# Altium project MainBoard_V1p0.PrjPcb
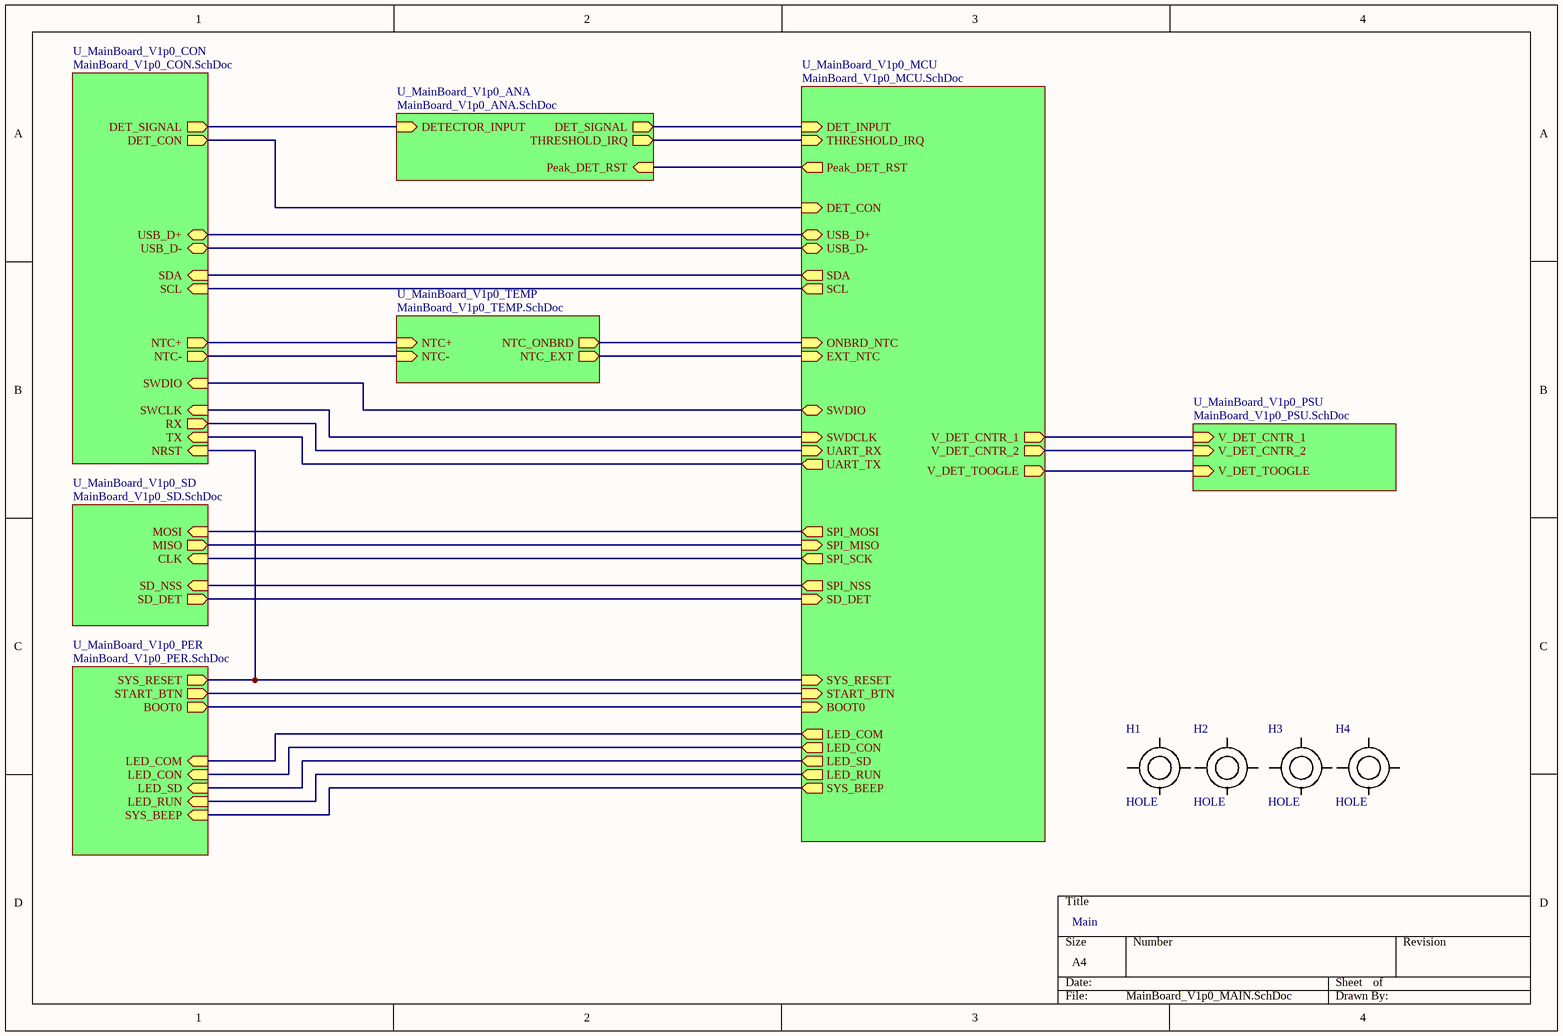
[diagram p0: MainBoard_V1p0_MAIN.SchDoc]
8 sheets, 206 parts. Net scope: hierarchical (ports join the sheet entries above them; power ports are global).
Board file: MainBoard_V1p0.PcbDoc
Sheets:
  MainBoard_V1p0_MAIN.SchDoc
    U_MainBoard_V1p0_ANA = MainBoard_V1p0_ANA.SchDoc
    U_MainBoard_V1p0_CON = MainBoard_V1p0_CON.SchDoc
    U_MainBoard_V1p0_MCU = MainBoard_V1p0_MCU.SchDoc
    U_MainBoard_V1p0_PER = MainBoard_V1p0_PER.SchDoc
    U_MainBoard_V1p0_PSU = MainBoard_V1p0_PSU.SchDoc
    U_MainBoard_V1p0_SD = MainBoard_V1p0_SD.SchDoc
    U_MainBoard_V1p0_TEMP = MainBoard_V1p0_TEMP.SchDoc

## Sheet MainBoard_V1p0_MAIN.SchDoc
size A4; SheetNumber: 1; SheetTotal: 8

### Parts
H1  HOLE  [HOLE_140_160MIL]
H2  HOLE  [HOLE_140_160MIL]
H3  HOLE  [HOLE_140_160MIL]
H4  HOLE  [HOLE_140_160MIL]

### Sub-sheets
U_MainBoard_V1p0_ANA = MainBoard_V1p0_ANA.SchDoc: DETECTOR_INPUT (in), DET_SIGNAL (out), Peak_DET_RST (in), THRESHOLD_IRQ (out)
U_MainBoard_V1p0_CON = MainBoard_V1p0_CON.SchDoc: USB_D- (bidir), USB_D+ (bidir), DET_SIGNAL (out), NTC+ (out), NTC- (out), SCL (in), SDA (in), DET_CON (out), RX (out), SWCLK (in), SWDIO (in), NRST (in), TX (in)
U_MainBoard_V1p0_MCU = MainBoard_V1p0_MCU.SchDoc: SPI_NSS (out), SPI_SCK (out), SPI_MISO (in), SPI_MOSI (out), SCL (out), SDA (out), DET_INPUT (in), ONBRD_NTC (in), EXT_NTC (in), THRESHOLD_IRQ (in), SYS_RESET (in), START_BTN (in), SYS_BEEP (out), LED_COM (out), LED_CON (out), LED_SD (out), LED_RUN (out), UART_TX (out), UART_RX (in), USB_D- (bidir), USB_D+ (bidir), SWDIO (bidir), SWDCLK (in), Peak_DET_RST (out), V_DET_CNTR_1 (out), V_DET_CNTR_2 (out), BOOT0 (in), DET_CON (in), SD_DET (in), V_DET_TOOGLE (out)
U_MainBoard_V1p0_PER = MainBoard_V1p0_PER.SchDoc: LED_COM (in), LED_CON (in), LED_SD (in), LED_RUN (in), SYS_BEEP (in), SYS_RESET (out), START_BTN (out), BOOT0 (out)
U_MainBoard_V1p0_PSU = MainBoard_V1p0_PSU.SchDoc: V_DET_CNTR_1 (in), V_DET_CNTR_2 (in), V_DET_TOOGLE (in)
U_MainBoard_V1p0_SD = MainBoard_V1p0_SD.SchDoc: SD_DET (out), SD_NSS (in), MOSI (in), CLK (in), MISO (out)
U_MainBoard_V1p0_TEMP = MainBoard_V1p0_TEMP.SchDoc: NTC+ (in), NTC- (in), NTC_ONBRD (out), NTC_EXT (out)

### Nets
BOOT0: sheet U_MainBoard_V1p0_MCU/BOOT0, sheet U_MainBoard_V1p0_PER/BOOT0
CLK: sheet U_MainBoard_V1p0_MCU/SPI_SCK, sheet U_MainBoard_V1p0_SD/CLK
DET_CON: sheet U_MainBoard_V1p0_CON/DET_CON, sheet U_MainBoard_V1p0_MCU/DET_CON
DET_SIGNAL: sheet U_MainBoard_V1p0_ANA/DETECTOR_INPUT, sheet U_MainBoard_V1p0_CON/DET_SIGNAL
EXT_NTC: sheet U_MainBoard_V1p0_MCU/EXT_NTC, sheet U_MainBoard_V1p0_TEMP/NTC_EXT
LED_COM: sheet U_MainBoard_V1p0_MCU/LED_COM, sheet U_MainBoard_V1p0_PER/LED_COM
LED_CON: sheet U_MainBoard_V1p0_MCU/LED_CON, sheet U_MainBoard_V1p0_PER/LED_CON
LED_RUN: sheet U_MainBoard_V1p0_MCU/LED_RUN, sheet U_MainBoard_V1p0_PER/LED_RUN
LED_SD: sheet U_MainBoard_V1p0_MCU/LED_SD, sheet U_MainBoard_V1p0_PER/LED_SD
MISO: sheet U_MainBoard_V1p0_MCU/SPI_MISO, sheet U_MainBoard_V1p0_SD/MISO
MOSI: sheet U_MainBoard_V1p0_MCU/SPI_MOSI, sheet U_MainBoard_V1p0_SD/MOSI
NTC+: sheet U_MainBoard_V1p0_CON/NTC+, sheet U_MainBoard_V1p0_TEMP/NTC+
NTC-: sheet U_MainBoard_V1p0_CON/NTC-, sheet U_MainBoard_V1p0_TEMP/NTC-
ONBRD_NTC: sheet U_MainBoard_V1p0_MCU/ONBRD_NTC, sheet U_MainBoard_V1p0_TEMP/NTC_ONBRD
Peak_DET_RST: sheet U_MainBoard_V1p0_ANA/Peak_DET_RST, sheet U_MainBoard_V1p0_MCU/Peak_DET_RST
SCL: sheet U_MainBoard_V1p0_CON/SCL, sheet U_MainBoard_V1p0_MCU/SCL
SD_DET: sheet U_MainBoard_V1p0_MCU/SD_DET, sheet U_MainBoard_V1p0_SD/SD_DET
SD_NSS: sheet U_MainBoard_V1p0_MCU/SPI_NSS, sheet U_MainBoard_V1p0_SD/SD_NSS
SDA: sheet U_MainBoard_V1p0_CON/SDA, sheet U_MainBoard_V1p0_MCU/SDA
START_BTN: sheet U_MainBoard_V1p0_MCU/START_BTN, sheet U_MainBoard_V1p0_PER/START_BTN
SWDCLK: sheet U_MainBoard_V1p0_CON/SWCLK, sheet U_MainBoard_V1p0_MCU/SWDCLK
SWDIO: sheet U_MainBoard_V1p0_CON/SWDIO, sheet U_MainBoard_V1p0_MCU/SWDIO
SYS_BEEP: sheet U_MainBoard_V1p0_MCU/SYS_BEEP, sheet U_MainBoard_V1p0_PER/SYS_BEEP
SYS_RESET: sheet U_MainBoard_V1p0_CON/NRST, sheet U_MainBoard_V1p0_MCU/SYS_RESET, sheet U_MainBoard_V1p0_PER/SYS_RESET
THRESHOLD_IRQ: sheet U_MainBoard_V1p0_ANA/THRESHOLD_IRQ, sheet U_MainBoard_V1p0_MCU/THRESHOLD_IRQ
UART_RX: sheet U_MainBoard_V1p0_CON/RX, sheet U_MainBoard_V1p0_MCU/UART_RX
UART_TX: sheet U_MainBoard_V1p0_CON/TX, sheet U_MainBoard_V1p0_MCU/UART_TX
USB_D+: sheet U_MainBoard_V1p0_CON/USB_D+, sheet U_MainBoard_V1p0_MCU/USB_D+
USB_D-: sheet U_MainBoard_V1p0_CON/USB_D-, sheet U_MainBoard_V1p0_MCU/USB_D-
V_DET_CNTR_1: sheet U_MainBoard_V1p0_MCU/V_DET_CNTR_1, sheet U_MainBoard_V1p0_PSU/V_DET_CNTR_1
V_DET_CNTR_2: sheet U_MainBoard_V1p0_MCU/V_DET_CNTR_2, sheet U_MainBoard_V1p0_PSU/V_DET_CNTR_2
V_DET_TOOGLE: sheet U_MainBoard_V1p0_MCU/V_DET_TOOGLE, sheet U_MainBoard_V1p0_PSU/V_DET_TOOGLE
NetR31_1: sheet U_MainBoard_V1p0_ANA/DET_SIGNAL, sheet U_MainBoard_V1p0_MCU/DET_INPUT

### Notes on the sheet
- Main

## Sheet MainBoard_V1p0_ANA.SchDoc
size A4; SheetNumber: 4; SheetTotal: 8
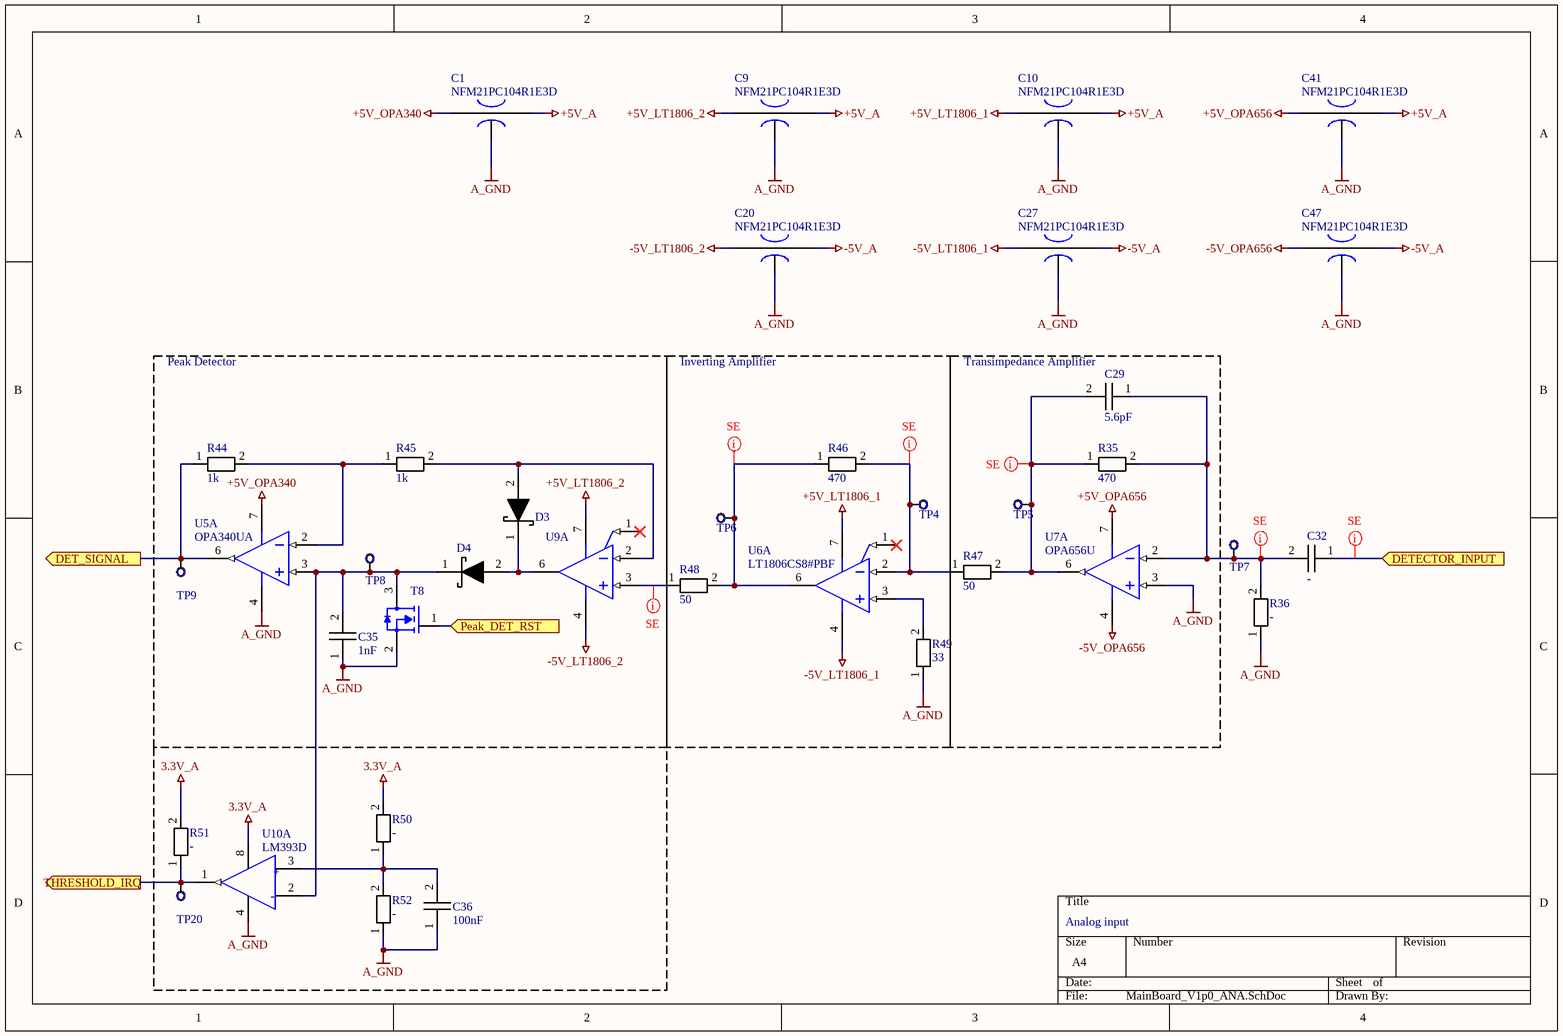
[diagram p1: MainBoard_V1p0_ANA.SchDoc]

### Parts
C1  NFM21PC104R1E3D  [MURATA_NFM21]
C9  NFM21PC104R1E3D  [MURATA_NFM21]
C10  NFM21PC104R1E3D  [MURATA_NFM21]
C20  NFM21PC104R1E3D  [MURATA_NFM21]
C27  NFM21PC104R1E3D  [MURATA_NFM21]
C29  5.6pF  [0805_C]
C32  -  [0805_C]
C35  1nF  [0805_C]
C36  100nF  [0805_C]
C41  NFM21PC104R1E3D  [MURATA_NFM21]
C47  NFM21PC104R1E3D  [MURATA_NFM21]
D3  DIODE_SCHOTTKY  [SMD_DIODE_SOD80]  (value not drawn)
D4  DIODE_SCHOTTKY  [SMD_DIODE_SOD80]  (value not drawn)
R35  470  [0805]
R36  -  [0805]
R44  1k  [0805]
R45  1k  [0805]
R46  470  [0805]
R47  50  [0805]
R48  50  [0805]
R49  33  [0805]
R50  -  [0805]
R51  -  [0805]
R52  -  [0805]
T8  MMBF170  [SOT23]  (value not drawn)
TP4  ?  [PAD_40]  (value not drawn)  (no BOM)
TP5  ?  [PAD_40]  (value not drawn)  (no BOM)
TP6  ?  [PAD_40]  (value not drawn)  (no BOM)
TP7  ?  [PAD_40]  (value not drawn)  (no BOM)
TP8  ?  [PAD_40]  (value not drawn)  (no BOM)
TP9  ?  [PAD_40]  (value not drawn)  (no BOM)
TP20  ?  [PAD_40]  (value not drawn)  (no BOM)
U5  OPA340UA  [SO-8]  (part A of 2)
U6  LT1806CS8#PBF  [SO-8]  (part A of 2)
U7  OPA656U  [SO-8]  (part A of 2)
U9  LT1806CS8#PBF  [SO-8]  (value not drawn)  (part A of 2)
U10  LM393D  [SO-8]  (part A of 2)

### Blocks framed on the sheet
Peak Detector: C35 D3 D4 R44 R45 T8 TP8 TP9 U5 U9
Inverting Amplifier: R46 R48 R49 TP4 TP6 U6
Transimpedance Amplifier: C29 R35 R47 TP5 U7

### Ports
DET_SIGNAL (out), DETECTOR_INPUT (in), Peak_DET_RST (in), THRESHOLD_IRQ (out)

### Nets
3.3V_A: R50.2 R51.2 U10.8(Vcc+)
+5V_A: C1.3(OUT) C9.3(OUT) C10.3(OUT) C41.3(OUT)
+5V_LT1806_1: C10.1(IN) U6.7(V+)
+5V_LT1806_2: C9.1(IN) U9.7(V+)
+5V_OPA340: C1.1(IN) U5.7(V+)
+5V_OPA656: C41.1(IN) U7.7(VS+)
-5V_A: C20.3(OUT) C27.3(OUT) C47.3(OUT)
-5V_LT1806_1: C27.1(IN) U6.4(V-)
-5V_LT1806_2: C20.1(IN) U9.4(V-)
-5V_OPA656: C47.1(IN) U7.4(VS-)
A_GND: C1.2(GND) C9.2(GND) C10.2(GND) C20.2(GND) C27.2(GND) C35.1 C36.1 C41.2(GND) C47.2(GND) R36.1 R49.1 R52.1 T8.2(Source) U5.4(V-) U7.3(IN+) U10.4(Vcc-)
DET_SIGNAL: C32.1 ; port DETECTOR_INPUT
Peak_DET_RST: T8.1(Gate) ; port Peak_DET_RST
THRESHOLD_IRQ: R51.1 TP20.1 U10.1(Out1) ; port THRESHOLD_IRQ
NetC29_1: C29.1 C32.2 R35.2 R36.2 TP7.1 U7.2(IN-)
NetC29_2: C29.2 R35.1 R47.2 TP5.1 U7.6(OUT)
NetC35_2: C35.2 D4.1 T8.3(Drain) TP8.1 U5.3(IN+) U10.2(In1-)
NetC36_2: C36.2 R50.1 R52.2 U10.3(In1+)
NetD3_1: D3.1 D4.2 U9.6(OUT)
NetD3_2: D3.2 R45.2 U9.2(-IN)
NetR31_1: R44.1 TP9.1 U5.6(OUT) ; port DET_SIGNAL
NetR44_2: R44.2 R45.1 U5.2(IN-)
NetR46_1: R46.1 R48.2 TP6.1 U6.6(OUT)
NetR46_2: R46.2 R47.1 TP4.1 U6.2(-IN)
NetR48_1: R48.1 U9.3(+IN)
NetR49_2: R49.2 U6.3(+IN)

Not connected (* = marked no-connect by the designer): U6 1(~{SHDN})*; U9 1(~{SHDN})*

### Layout directives
net class SINGLE50: DET_SIGNAL, NetC29_1, NetC29_2, NetR46_1, NetR46_2, NetR48_1

### Notes on the sheet
- Analog input
- (in symbol LM393D, part A) +; -

### Library data of the parts
C1 C9 C10 C20 C27 C41 C47 = EMIFIL_CAP: NFM21PC104R1E3D / 100nF/25V
C29 C32 C35 C36 = CAPACITOR
R35 R36 R44-R52 = RESISTOR: Parameter 1: 10k
T8 = MMBF170: N MOSFET
TP4-TP9 TP20 = TESTPOINT
U5 = OPA340UA: Single-Supply, Rail-to-Rail Operational Amplifier MicroAmplifier(TM) Series, 2.7 to 5.5 V, -40 to 85 degC, 8-pin SOIC (D8), Green (RoHS & no Sb/Br); Manufacturer: Texas Instruments; Vio (25C)(Max)(mV): 0.5; Sub Family: Low Input Bias Current Amp (<=10pA), Low Offset Voltage Amplifier (<=500uV), Low Supply Voltage Amplifier (<=2.7V), Precision Amplifier; Vn at 1kHz(Typ)(nV/rtHz): 25; Number of Channels: 1; Offset Drift(Typ)(uV/C): 2.5; Total Supply Voltage(Min)(+5V is 5, +/-5V is 10): 2.7; Slew Rate(Typ)(V/us): 6; Total Supply Voltage(Max)(+5V is 5, +/-5V is 10): 5.5; Iq per channel(Max)(mA): 0.95; CMRR(Min)(dB): 80; IIB(Max)(pA): 10; Code_JEDEC: MS-012; PackageDescription: 8-Pin Plastic Small Outline, Body 4.9 x 3.9 mm, Pitch 1.27 mm; ComponentLink3Description: Package Specification; ComponentLink1Description: Manufacturer URL; DatasheetVersion: SBOS073B; PackageReference: D0008A; PackageVersion: 4040047-3/M, 06/2011; ComponentLink3URL: http://www.ti.com/litv/pdf/msoi002j; ComponentLink1URL: http://www.ti.com/; Mounting Technology: Surface Mount; ComponentLink2URL: http://www.ti.com/general/docs/lit/getliterature.tsp?genericPartNumber=OPA340&fileType=pdf; PartNumber: OPA340UA; ComponentLink2Description: Datasheet; Eco-Plan: Green (RoHS & no Sb/Br)
U6 U9 = LT1806: Single Channel, High Speed, Low Noise Precision Operational Amplifier, 325 MHz Typical GBW, 125 V/us Typical SR, 2.5 to 12.6 V, 8-Pin SOIC (S8-8), Commercial, Pb-Free; Manufacturer: Linear Technology; Is (mA) Typical: 9; GBW (MHz) Typical: 325; SR (V/us) Typical: 125; Vos (mV) Guaranteed: 0.55; Vos (mV) Typical: 0.1; Vs Max (V): 12.6; Vs Min (V): 2.5; Channels (#): 1; DatasheetVersion: Rev. C; ComponentLink3Description: Package Specification; Mounting Technology: Surface Mount; ComponentLink2Description: Datasheet; RevisionNote: URLs updated; PackageDescription: 8-Pin Plastic Small Outline, Body 4.9 x 3.9 mm, Pitch 1.27 mm; PackageVersion: Rev G; RoHS: Pb-Free; Type: VFB; PackageReference: LT-S8-8; ComponentLink2URL: http://cds.linear.com/docs/en/datasheet/18067fc.pdf; Linear Technology Part Number: LT1806; ComponentLink3URL: http://cds.linear.com/docs/en/packaging/05081610_G_SO8.pdf; PartNumber: LT1806CS8#PBF; ComponentLink1Description: Manufacturer URL; ComponentLink1URL: http://www.linear.com/
U7 = OPA656: Wideband, Unity Gain Stable FET-Input Operational Amplifier, 10 to 12 V, -40 to 85 degC, 8-pin SOIC (D8), Green (RoHS & no Sb/Br); Manufacturer: Texas Instruments; BW @ Acl(MHz): 500; Acl, min stable gain(V/V): 1; THD (Fc is 1 MHz)(Typ)(dB): -74; Io(Typ)(mA): 70; @ MHz: 5; Vn at Flatband(Typ)(nV/rtHz): 7; 3rd Harmonic(dBc): 100; Slew Rate(Typ)(V/us): 290; 2nd Harmonic(dBc): 74; Vs(Min)(V): 10; Vs(Max)(V): 12; Iib(Max)(nA): 0.02; Settling Time (0.1%)(Typ)(ns): 16; Vio(Max)(mV): 0.6; Diff Phase(deg): 0.05; Sub Family: High Output Current Amplifier (>=50mA), High Speed Amplifier (>=50MHz), Low Input Bias Current Amp (<=10pA); PartNumber: OPA656U; ComponentLink1URL: http://www.ti.com/; ComponentLink2URL: http://www.ti.com/general/docs/lit/getliterature.tsp?genericPartNumber=OPA656&fileType=pdf; Mounting Technology: Surface Mount; Code_JEDEC: MS-012; PackageReference: D0008A; ComponentLink3URL: http://www.ti.com/litv/pdf/msoi002j; PackageVersion: 4040047-3/M, 06/2011; ComponentLink3Description: Package Specification; Number of Channels: 1; DatasheetVersion: SBOS196G; Iq per channel(Max)(mA): 16; ComponentLink2Description: Datasheet; ComponentLink1Description: Manufacturer URL; Eco-Plan: Green (RoHS & no Sb/Br); Diff Gain(%): 0.02; PackageDescription: 8-Pin Plastic Small Outline, Body 4.9 x 3.9 mm, Pitch 1.27 mm
U10 = LM393D: IC VOLT COMPARATOR DUAL LP 8SOIC; Manufacturer: STMicroelectronics; Response Time: 1.3us; Min Supply Voltage: 2V; Input Offset Voltage: 1mV; Input Bias Current: 0.02uA; Max Dual Supply Voltage: 18V; Output Current Per Channel: 18mA; Max Junction Temp: +150°C; Standoff Height: 0.1mm; Number Of Channels: 2; Nominal Supply Current: 0.45-0.6mA; Voltage Gain: 200V/mV; Max Supply Voltage: 36V; Min Dual Supply Voltage: 1V; Ambient Temperature Range Low: 0°C; ComponentLink2Description: Datasheet; Lead Free: Yes; Device Class L3: Comparators; Device Class L2: Linear ICs; Manufacturer Part Number: LM393D; Digikey Description: IC VOLT COMPARATOR DUAL LP 8SOIC; Category: IC; Octopart: https://octopart.com/lm393d-stmicroelectronics-25832; Package: SO8; RoHS: TRUE; Footprint Url: https://www.st.com/resource/en/datasheet/stm8l001j3.pdf; Temperature Range Low: 0°C; Temperature Range High: +70°C; Mouser Description: Analog Comparators Lo-Pwr Dual Voltage; ComponentLink2URL: https://www.st.com/resource/en/datasheet/lm393.pdf; Automotive: No; Temperature: 0°C to +70°C; Height: 1.75mm; Device Class L1: Integrated Circuits (ICs); Ambient Temperature Range High: +70°C

## Sheet MainBoard_V1p0_CON.SchDoc
size A4; SheetNumber: 6; SheetTotal: 8
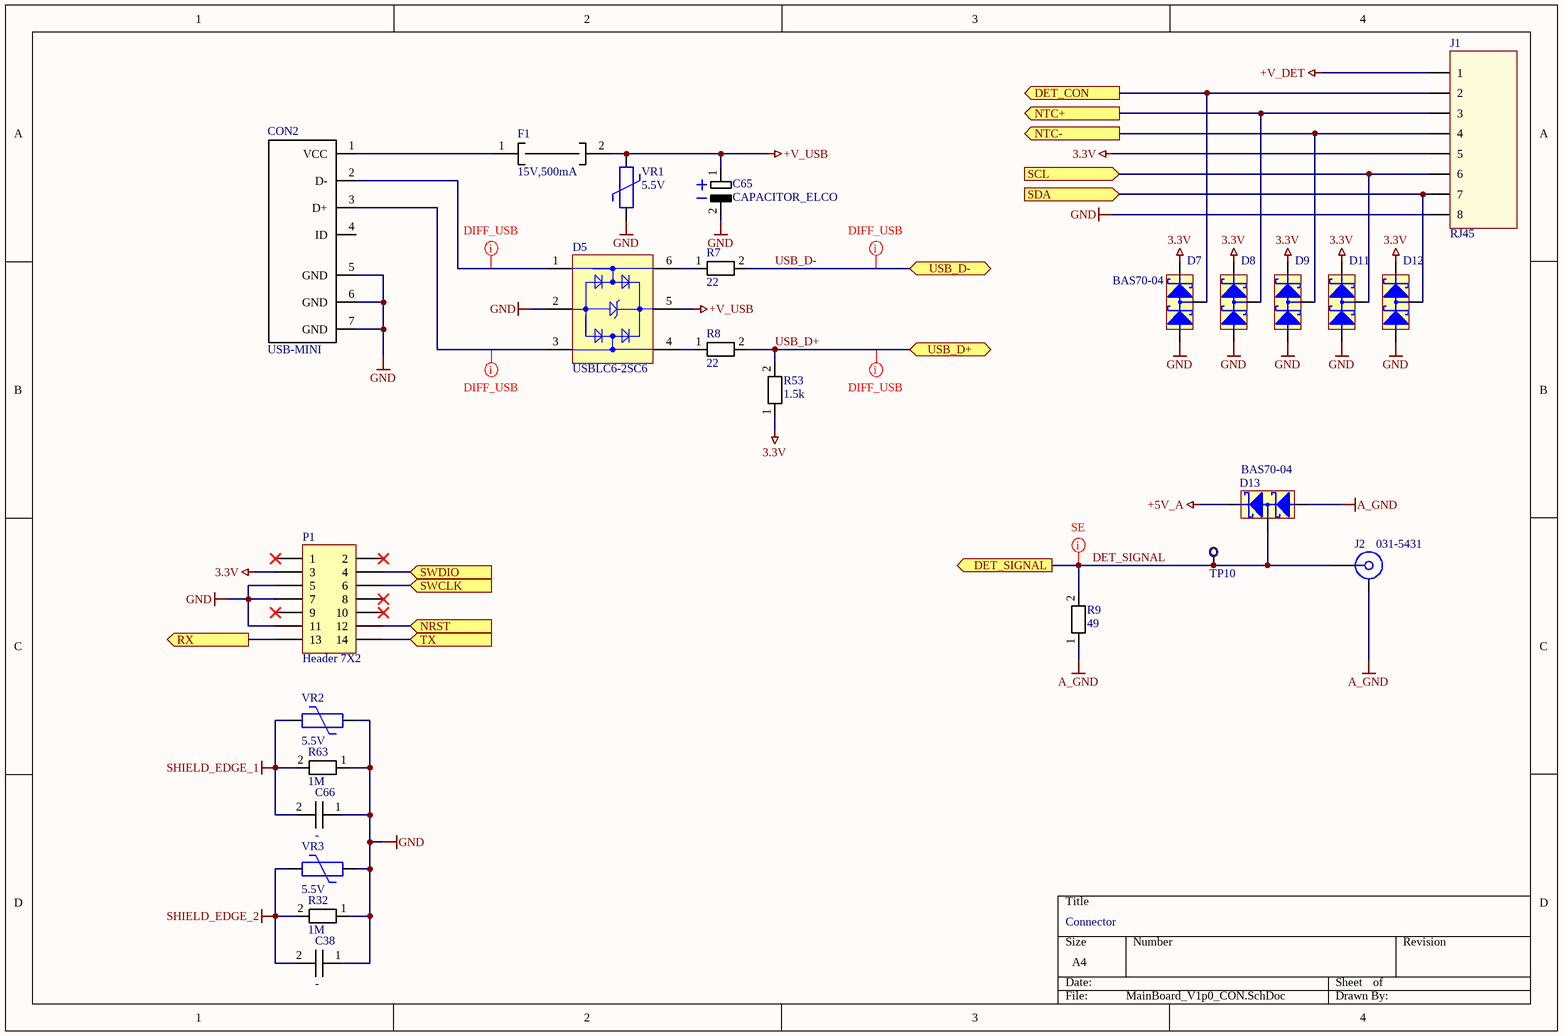
[diagram p2: MainBoard_V1p0_CON.SchDoc]

### Parts
C38  -  [0805_C]
C65  CAPACITOR_ELCO  [CAPAE9383X110M]
C66  -  [0805_C]
CON2  USB-MINI  [USB-MINI]
D5  USBLC6-2SC6  [STM-SOT23-6L_V]
D7  BAS70-04  [SOT23]
D8  BAS70-04  [SOT23]  (value not drawn)
D9  BAS70-04  [SOT23]  (value not drawn)
D11  BAS70-04  [SOT23]  (value not drawn)
D12  BAS70-04  [SOT23]  (value not drawn)
D13  BAS70-04  [SOT23]
F1  15V,500mA  [FUSE_1812L]
J1  RJ45  [RJ45_DEG90]
J2  031-5431  [CON_BNC_TE_ZDC]
P1  Header 7X2  [HDR2X7]
R7  22  [0805]
R8  22  [0805]
R9  49  [0805]
R32  1M  [0805]
R53  1.5k  [0805]
R63  1M  [0805]
TP10  ?  [PAD_40]  (value not drawn)  (no BOM)
VR1  5.5V  [0805]
VR2  5.5V  [0805]
VR3  5.5V  [0805]

### Ports
DET_CON (out), DET_SIGNAL (out), NRST (in), NTC+ (out), NTC- (out), RX (out), SCL (in), SDA (in), SWCLK (in), SWDIO (in), TX (in), USB_D+ (bidir), USB_D- (bidir)

### Nets
3.3V: D7.2 D8.2 D9.2 D11.2 D12.2 J1.5 P1.3 R53.1
+5V_A: D13.2
+V_DET: J1.1
+V_USB: C65.1 D5.5(VBUS) F1.2 VR1.2
A_GND: D13.1 J2.2,3,4(GND) R9.1
GND: C38.1 C65.2 C66.1 CON2.5(GND) CON2.6(GND) CON2.7(GND) D5.2(GND) D7.1 D8.1 D9.1 D11.1 D12.1 J1.8 P1.5 P1.7 P1.11 R32.1 R63.1 VR1.1 VR2.1 VR3.1
SHIELD_EDGE_1: C66.2 R63.2 VR2.2
SHIELD_EDGE_2: C38.2 R32.2 VR3.2
DET_CON: D7.3 J1.2 ; port DET_CON
DET_SIGNAL: D13.3 J2.1(SIGNAL) R9.2 TP10.1 ; port DET_SIGNAL
NTC+: D8.3 J1.3 ; port NTC+
NTC-: D9.3 J1.4 ; port NTC-
SCL: D11.3 J1.6 ; port SCL
SDA: D12.3 J1.7 ; port SDA
SWDCLK: P1.6 ; port SWCLK
SWDIO: P1.4 ; port SWDIO
SYS_RESET: P1.12 ; port NRST
UART_RX: P1.13 ; port RX
UART_TX: P1.14 ; port TX
USB_D+: R8.2 R53.2 ; port USB_D+
USB_D-: R7.2 ; port USB_D-
NetCON2_1: CON2.1(VCC) F1.1
NetCON2_2: CON2.2(D-) D5.1(I/O_1)
NetCON2_3: CON2.3(D+) D5.3(I/O_2)
NetD5_4: D5.4(I/O_3) R8.1
NetD5_6: D5.6(I/O_4) R7.1

Not connected (* = marked no-connect by the designer): CON2 4(ID); P1 1* 2* 8* 9* 10*

### Layout directives
net class D90: NetCON2_2, NetCON2_3, USB_D+, USB_D-
net class SINGLE50: DET_SIGNAL

### Notes on the sheet
- Connector

### Library data of the parts
C38 C66 = CAPACITOR
D5 = USBLC6-2SC6: Very low capacitance ESD protection, 3.5 pF, -40 to 125 degC, 6-Pin SOT23, RoHS, Tape and Reel; Manufacturer: STMicroelectronics; Polarity: Uni-Directional; Clamping Voltage: 17V; Rad Hardened: No; Product Height (mm): 1.3mm; Leakage Current (Max): 0.15uA; Product Length (mm): 3.05mm; Number of Elements: 1; Peak Pulse Current: 5A; Configuration: Dual; Reverse Breakdown Voltage: 6V; Working Voltage (Max): 5V; Capacitance Value: 3.5pF; Suppressor Type: DiodeArrays; Product Depth (mm): 1.75mm; Test Current (It): 1mA; Package / Case: SOT-23; Operating Temperature Max Deg. C: 125C; Package Description: 6-Pin Small Outline Transistor, Body 2.925 x 1.625 mm, Pitch 0.95 mm; Package Reference: SOT23-6L; Datasheet Version: Rev. 5, 10/2011; Operating Temperature Min Deg. C: -40C; Mounting Style: SurfaceMount; Direction Type: Uni-Directional; Mounting: SurfaceMount; Pin Count: 6; Leakage Current: 0.15uA; Packaging: TapeandReel; Operating Temperature Classification: Automotive; Clamping Voltage (Max): 17V; Manufacturer URL: http://www.st.com/; Reverse Stand-off Voltage: 5V; Datasheet URL: http://www.st.com/st-web-ui/static/active/en/resource/technical/document/datasheet/CD00050750.pdf; Working Voltage: 5V; Operating Temp Range: -40Cto125C
F1 = FUSE
J1 = RJ45: 90 deg RJ45 connector, without transformer / 180 deg RJ45 connector without transformer
J2 = Amphenol 031-5431: 50R BNC Right Angle Jack, Amphenol 031-5431
P1 = Header 7X2: Header, 7-Pin, Dual row; LatestRevisionDate: 17-Jul-2002; LatestRevisionNote: Re-released for DXP Platform.; Publisher: Altium Limited
R7-R9 R32 R53 R63 = RESISTOR: Parameter 1: 10k
TP10 = TESTPOINT
VR1-VR3 = VARISTOR

## Sheet MainBoard_V1p0_MCU.SchDoc
size A4; SheetNumber: 3; SheetTotal: 8
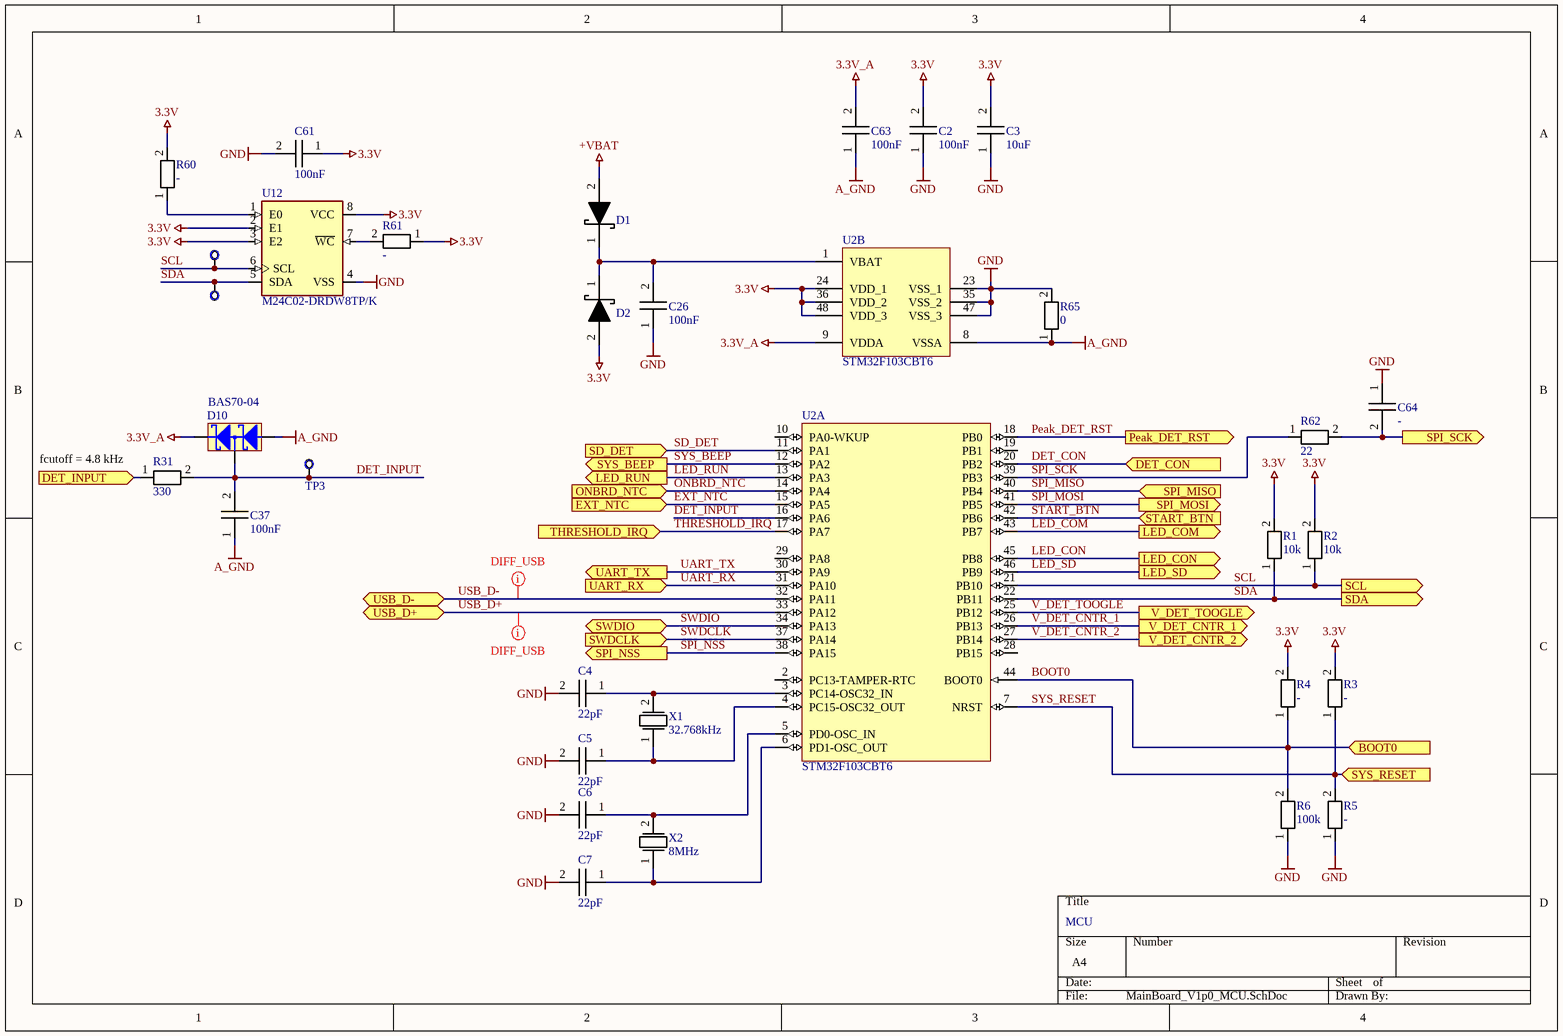
[diagram p3: MainBoard_V1p0_MCU.SchDoc]

### Parts
C2  100nF  [0805_C]
C3  10uF  [1210_C]
C4  22pF  [0805_C]
C5  22pF  [0805_C]
C6  22pF  [0805_C]
C7  22pF  [0805_C]
C26  100nF  [0805_C]
C37  100nF  [0805_C]
C61  100nF  [0805_C]
C63  100nF  [0805_C]
C64  -  [0805_C]
D1  DIODE_SCHOTTKY  [SMD_DIODE_SOD80]  (value not drawn)
D2  DIODE_SCHOTTKY  [SMD_DIODE_SOD80]  (value not drawn)
D10  BAS70-04  [SOT23]
R1  10k  [0805]
R2  10k  [0805]
R3  -  [0805]
R4  -  [0805]
R5  -  [0805]
R6  100k  [0805]
R31  330  [0805]
R60  -  [0805]
R61  -  [0805]
R62  22  [0805]
R65  0  [0805]
TP1  ?  [PAD_40]  (value not drawn)  (no BOM)
TP2  ?  [PAD_40]  (value not drawn)  (no BOM)
TP3  ?  [PAD_40]  (value not drawn)  (no BOM)
U2  STM32F103CBT6  [STM-LQFP48_N]  (parts A,B of 2)
U12  M24C02-DRDW8TP/K  [TSSOP8]
X1  32.768kHz  [XTAL_SMALL]
X2  8MHz  [XTAL_SMALL]

### Ports
BOOT0 (in), DET_CON (in), DET_INPUT (in), EXT_NTC (in), LED_COM (out), LED_CON (out), LED_RUN (out), LED_SD (out), ONBRD_NTC (in), Peak_DET_RST (out), SCL (out), SD_DET (in), SDA (out), SPI_MISO (in), SPI_MOSI (out), SPI_NSS (out), SPI_SCK (out), START_BTN (in), SWDCLK (in), SWDIO (bidir), SYS_BEEP (out), SYS_RESET (in), THRESHOLD_IRQ (in), UART_RX (in), UART_TX (out), USB_D+ (bidir), USB_D- (bidir), V_DET_CNTR_1 (out), V_DET_CNTR_2 (out), V_DET_TOOGLE (out)

### Nets
3.3V: C2.2 C3.2 C61.1 D2.2 R1.2 R2.2 R3.2 R4.2 R60.2 R61.1 U2.24(VDD_1) U2.36(VDD_2) U2.48(VDD_3) U12.2(E1) U12.3(E2) U12.8(VCC)
3.3V_A: C63.2 D10.2 U2.9(VDDA)
+VBAT: D1.2
A_GND: C37.1 C63.1 D10.1 R65.1 U2.8(VSSA)
GND: C2.1 C3.1 C4.2 C5.2 C6.2 C7.2 C26.1 C61.2 C64.1 R5.1 R6.1 R65.2 U2.23(VSS_1) U2.35(VSS_2) U2.47(VSS_3) U12.4(VSS)
BOOT0: R4.1 R6.2 U2.44(BOOT0) ; port BOOT0
CLK: C64.2 R62.2 ; port SPI_SCK
DET_CON: U2.20(PB2) ; port DET_CON
DET_INPUT: C37.2 D10.3 R31.2 TP3.1 U2.16(PA6)
EXT_NTC: U2.15(PA5) ; port EXT_NTC
LED_COM: U2.43(PB7) ; port LED_COM
LED_CON: U2.45(PB8) ; port LED_CON
LED_RUN: U2.13(PA3) ; port LED_RUN
LED_SD: U2.46(PB9) ; port LED_SD
ONBRD_NTC: U2.14(PA4) ; port ONBRD_NTC
Peak_DET_RST: U2.18(PB0) ; port Peak_DET_RST
SCL: R2.1 TP1.1 U2.21(PB10) U12.6(SCL) ; port SCL
SD_DET: U2.11(PA1) ; port SD_DET
SDA: R1.1 TP2.1 U2.22(PB11) U12.5(SDA) ; port SDA
SPI_MISO: U2.40(PB4) ; port SPI_MISO  [project net MISO]
SPI_MOSI: U2.41(PB5) ; port SPI_MOSI  [project net MOSI]
SPI_NSS: U2.38(PA15) ; port SPI_NSS  [project net SD_NSS]
SPI_SCK: R62.1 U2.39(PB3)
START_BTN: U2.42(PB6) ; port START_BTN
SWDCLK: U2.37(PA14) ; port SWDCLK
SWDIO: U2.34(PA13) ; port SWDIO
SYS_BEEP: U2.12(PA2) ; port SYS_BEEP
SYS_RESET: R3.1 R5.2 U2.7(NRST) ; port SYS_RESET
THRESHOLD_IRQ: U2.17(PA7) ; port THRESHOLD_IRQ
UART_RX: U2.31(PA10) ; port UART_RX
UART_TX: U2.30(PA9) ; port UART_TX
USB_D+: U2.33(PA12) ; port USB_D+
USB_D-: U2.32(PA11) ; port USB_D-
V_DET_CNTR_1: U2.26(PB13) ; port V_DET_CNTR_1
V_DET_CNTR_2: U2.27(PB14) ; port V_DET_CNTR_2
V_DET_TOOGLE: U2.25(PB12) ; port V_DET_TOOGLE
NetC4_1: C4.1 U2.3(PC14-OSC32_IN) X1.2
NetC5_1: C5.1 U2.4(PC15-OSC32_OUT) X1.1
NetC6_1: C6.1 U2.5(PD0-OSC_IN) X2.2
NetC7_1: C7.1 U2.6(PD1-OSC_OUT) X2.1
NetC26_2: C26.2 D1.1 D2.1 U2.1(VBAT)
NetR31_1: R31.1 ; port DET_INPUT
NetR60_1: R60.1 U12.1(E0)
NetR61_2: R61.2 U12.7(~{WC})

Not connected (* = marked no-connect by the designer): U2 2(PC13-TAMPER-RTC) 10(PA0-WKUP) 19(PB1) 28(PB15) 29(PA8)

### Layout directives
net class D90: USB_D+, USB_D-

### Notes on the sheet
- (near R31) fcutoff = 4.8 kHz
- MCU

### Library data of the parts
C2-C7 C26 C37 C61 C63 C64 = CAPACITOR
R1 R2 = RESISTOR: Parameter 1: 10k
R3-R6 R31 R60-R62 R65 = RESISTOR: Parameter 1: 10k
TP1-TP3 = TESTPOINT
U2 = STM32F103CBT6: ARM Cortex-M3 32-bit MCU, 128 KB Flash, 20 KB Internal RAM, 37 I/Os, 48-pin LQFP, -40 to 85 degC, Tray; Supply Voltage(Vcc) min (V): 2; Operating Frequency(F) (Processor speed) (MHz): 72; A/D Converter: 2x12-bit (10 Channel); FLASH Size (Prog) (kB): 128; Internal RAM Size (kB): 20; I/Os (High Current): 37; ComponentLink2Description: Datasheet; PackageReference: LQFP48; PartNumber: STM32F103CBT6; ComponentLink1Description: Manufacturer URL; DatasheetVersion: Rev. 16; PackageVersion: Rev. 6, 06/2013; Packing: Tray; ComponentLink1URL: http://www.st.com/web/en/home.html; Mounting Technology: Surface Mount; ComponentLink3URL: http://www.st.com/st-web-ui/static/active/en/resource/technical/document/datasheet/DM00058181.pdf; PackageDescription: 48-Pin Low Profile Quad Flat Package, 7 x 7 mm Body, 0.5 mm Pitch; Core: ARM Cortex-M3; ComponentLink3Description: Package Specification; ComponentLink2URL: http://www.st.com/st-web-ui/static/active/en/resource/technical/document/datasheet/CD00161566.pdf
U12 = M24C02-FDW6TP: EEPROM Memory IC 2Kb (256 x 8) I2C 400kHz 900ns 8-TSSOP; MF: STMicroelectronics; Package: TSSOP-8 STMicroelectronics; MP: M24C02-FDW6TP; Digi-Key_Part_Number: 497-15746-1-ND; Value: *; SnapEDA_Link: https://www.snapeda.com/parts/M24C02-FDW6TP/STMicroelectronics/view-part/1102461/?ref=snap
X1 X2 = XTAL

## Sheet MainBoard_V1p0_PER.SchDoc
size A4; SheetNumber: 5; SheetTotal: 8
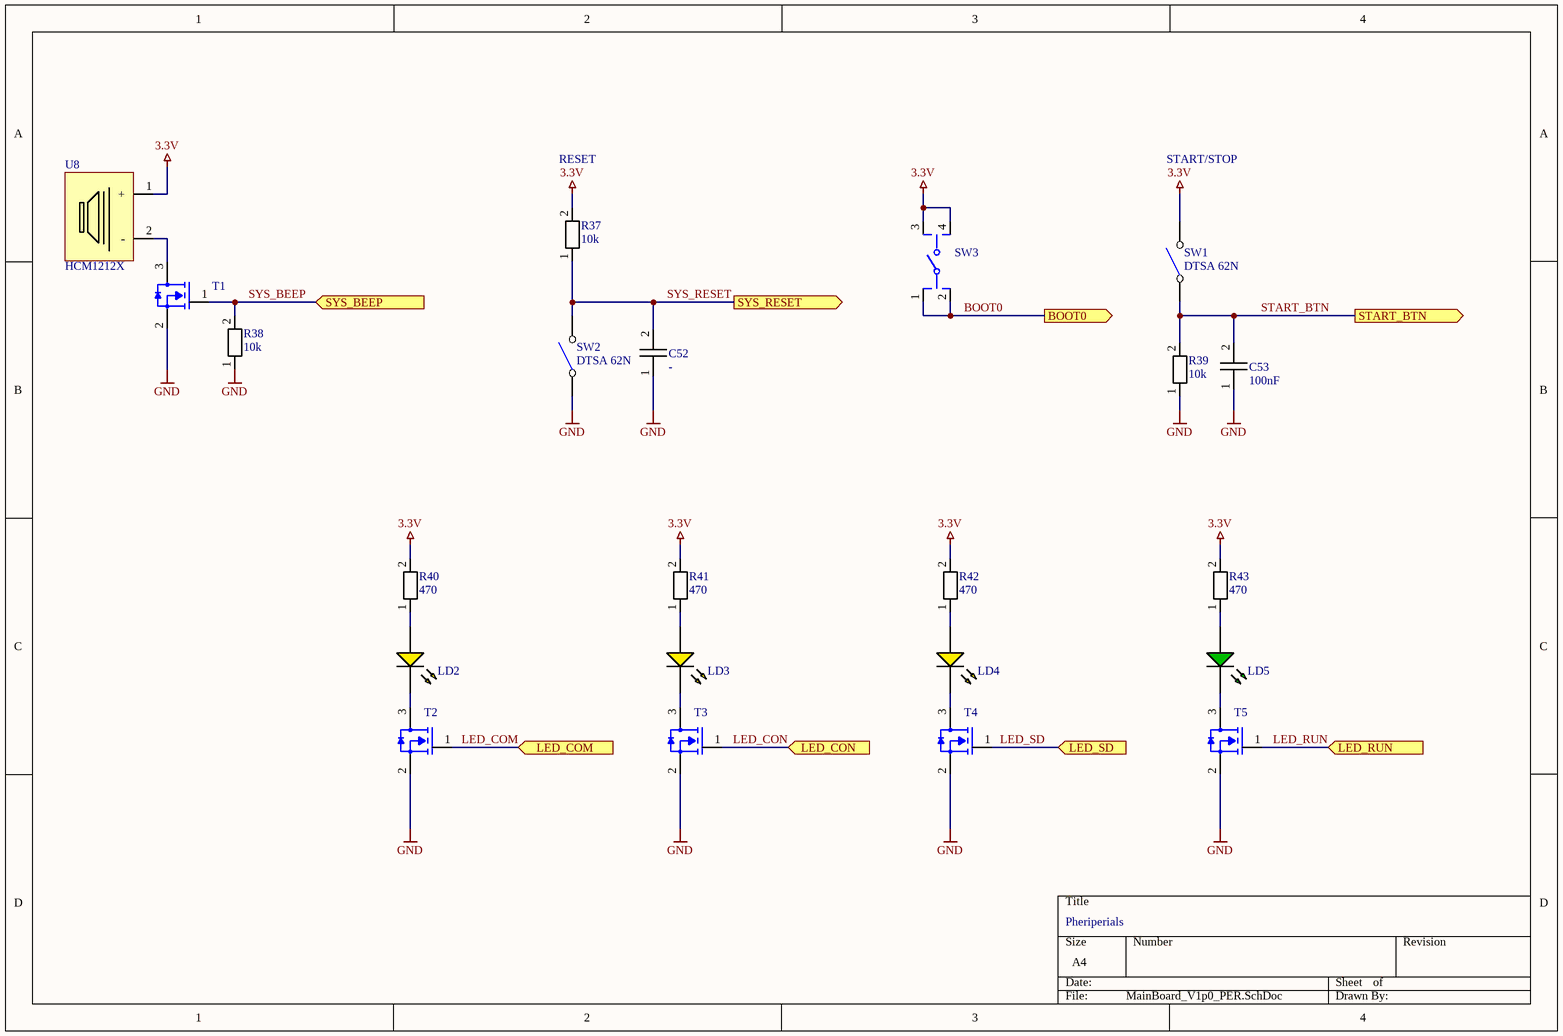
[diagram p4: MainBoard_V1p0_PER.SchDoc]

### Parts
C52  -  [0805_C]
C53  100nF  [0805_C]
LD2  LED_YEL  [LED_SMD_90DEG_YEL]  (value not drawn)
LD3  LED_YEL  [LED_SMD_90DEG_YEL]  (value not drawn)
LD4  LED_YEL  [LED_SMD_90DEG_YEL]  (value not drawn)
LD5  LED_GREEN  [LED_SMD_90DEG_GRE]  (value not drawn)
R37  10k  [0805]
R38  10k  [0805]
R39  10k  [0805]
R40  470  [0805]
R41  470  [0805]
R42  470  [0805]
R43  470  [0805]
SW1  DTSA 62N  [SW_DTSA-62N]
SW2  DTSA 62N  [SW_DTSA-62N]
SW3  Switch_C&K_KSC241JLFS_eec  [C&K_KSC241JLFS]  (value not drawn)
T1  MMBF170  [SOT23]  (value not drawn)
T2  MMBF170  [SOT23]  (value not drawn)
T3  MMBF170  [SOT23]  (value not drawn)
T4  MMBF170  [SOT23]  (value not drawn)
T5  MMBF170  [SOT23]  (value not drawn)
U8  HCM1212X  [HCM1212X]

### Ports
BOOT0 (out), LED_COM (in), LED_CON (in), LED_RUN (in), LED_SD (in), START_BTN (out), SYS_BEEP (in), SYS_RESET (out)

### Nets
3.3V: R37.2 R40.2 R41.2 R42.2 R43.2 SW1.2 SW3.3 SW3.4 U8.1(+)
GND: C52.1 C53.1 R38.1 R39.1 SW2.1 T1.2(Source) T2.2(Source) T3.2(Source) T4.2(Source) T5.2(Source)
BOOT0: SW3.1 SW3.2 ; port BOOT0
LED_COM: T2.1(Gate) ; port LED_COM
LED_CON: T3.1(Gate) ; port LED_CON
LED_RUN: T5.1(Gate) ; port LED_RUN
LED_SD: T4.1(Gate) ; port LED_SD
START_BTN: C53.2 R39.2 SW1.1 ; port START_BTN
SYS_BEEP: R38.2 T1.1(Gate) ; port SYS_BEEP
SYS_RESET: C52.2 R37.1 SW2.2 ; port SYS_RESET
NetLD2_A: LD2.A R40.1
NetLD2_K: LD2.K T2.3(Drain)
NetLD3_A: LD3.A R41.1
NetLD3_K: LD3.K T3.3(Drain)
NetLD4_A: LD4.A R42.1
NetLD4_K: LD4.K T4.3(Drain)
NetLD5_A: LD5.A R43.1
NetLD5_K: LD5.K T5.3(Drain)
NetT1_3: T1.3(Drain) U8.2(-)

### Notes on the sheet
- RESET
- START/STOP
- Pheriperials

### Library data of the parts
C52 C53 = CAPACITOR
LD2-LD4 = LED_YEL: Type (0°): LTSTC170YKT; Type (90°): HSMY-C110
LD5 = LED_GREEN: Type (0°): LTST-C170KGKT; Type (90°): HSMG-C110
R37-R39 = RESISTOR: Parameter 1: 10k
R40-R43 = RESISTOR: Parameter 1: 10k
SW1 SW2 = SW_DTSA 62N
SW3 = Switch_C&K_KSC241JLFS_eec: SWITCH TACTILE SPST-NO 0.05A 32V; Manufacturer: C&K; Part Number: KSC241JLFS; helpURL: https://upverter.com/upn/revision/9eb490e79e988993/; ComponentLink2Description: Datasheet; Temperature: -40°C to +85°C; Package: SMT_SW_6MM2_6MM2; Supplier 2: Mouser; Supplier 1: Digi-Key; ComponentLink1URL: https://upverter.com/upn/revision/9eb490e79e988993/; Supplier Part Number 2: 611-KSC241J-LFS; Supplier Part Number 1: 401-1762-1-ND; ComponentLink1Description: Upverter; ComponentLink2URL: http://www.ckswitches.com/media/1459/ksc.pdf; RoHS: TRUE; Mouser Part Number: 611-KSC241J-LFS; Digikey Description: SWITCH TACTILE SPST-NO 0.05A 32V; Digikey Part Number: 401-1762-1-ND; Lead Free: yes; Temperature Range Low: -40°C; Temperature Range High: +85°C
T1-T5 = MMBF170: N MOSFET

## Sheet MainBoard_V1p0_PSU.SchDoc
size A4; SheetNumber: 2; SheetTotal: 8
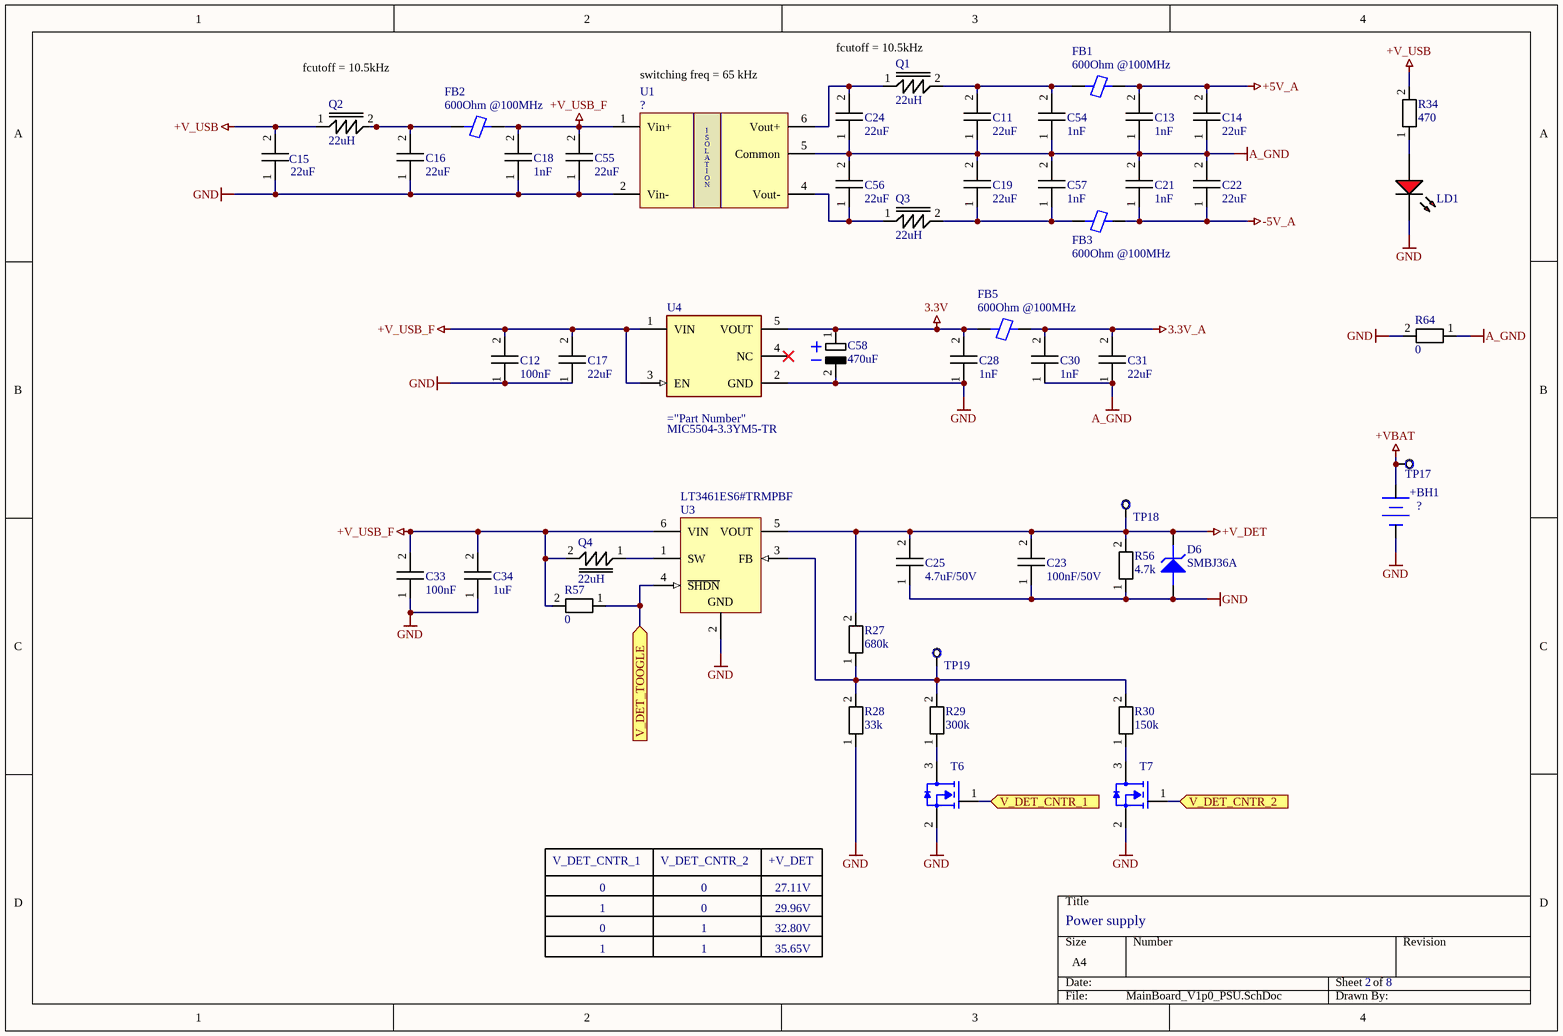
[diagram p5: MainBoard_V1p0_PSU.SchDoc]

### Parts
BH1  ?  [BATTERY_HOLDER_KEYSTONE_3002]
C11  22uF  [1210_C]
C12  100nF  [0805_C]
C13  1nF  [0805_C]
C14  22uF  [1210_C]
C15  22uF  [1210_C]
C16  22uF  [0805_C]
C17  22uF  [1210_C]
C18  1nF  [0805_C]
C19  22uF  [1210_C]
C21  1nF  [0805_C]
C22  22uF  [1210_C]
C23  100nF/50V  [0805_C]
C24  22uF  [1210_C]
C25  4.7uF/50V  [0805_C]
C28  1nF  [0805_C]
C30  1nF  [0805_C]
C31  22uF  [1210_C]
C33  100nF  [0805_C]
C34  1uF  [0805_C]
C54  1nF  [0805_C]
C55  22uF  [1210_C]
C56  22uF  [1210_C]
C57  1nF  [0805_C]
C58  470uF  [CAPAE9383X110M]
D6  SMBJ36A  [DO-214AA (SMB)]
FB1  600Ohm @100MHz  [0805_FB]
FB2  600Ohm @100MHz  [0805_FB]
FB3  600Ohm @100MHz  [0805_FB]
FB5  600Ohm @100MHz  [0805_FB]
LD1  LED_RED  [LED_SMD_90DEG_RED]  (value not drawn)
Q1  22uH  [1210]
Q2  22uH  [1210]
Q3  22uH  [1210]
Q4  22uH  [1210]
R27  680k  [0805]
R28  33k  [0805]
R29  300k  [0805]
R30  150k  [0805]
R34  470  [0805]
R56  4.7k  [0805]
R57  0  [0805]
R64  0  [0805]
T6  MMBF170  [SOT23]  (value not drawn)
T7  MMBF170  [SOT23]  (value not drawn)
TP17  ?  [PAD_40]  (value not drawn)  (no BOM)
TP18  ?  [PAD_40]  (value not drawn)  (no BOM)
TP19  ?  [PAD_40]  (value not drawn)  (no BOM)
U1  ?  [SIP_6]
U3  LT3461ES6#TRMPBF  [LT-S6-6-TSOT-23_L]
U4  MIC5504-3.3YM5-TR  [SOT23-5]

### Ports
V_DET_CNTR_1 (in), V_DET_CNTR_2 (in), V_DET_TOOGLE (in)

### Nets
3.3V: C28.2 C58.1 FB5.1 U4.5(VOUT)
3.3V_A: C30.2 C31.2 FB5.2
+5V_A: C13.2 C14.2 FB1.2
+V_DET: C23.2 C25.2 D6.K R27.2 R56.2 TP18.1 U3.5(VOUT)
+V_USB: C15.2 Q2.1 R34.2
+V_USB_F: C12.2 C17.2 C18.2 C33.2 C34.2 C55.2 FB2.2 Q4.2 R57.2 U1.1(Vin+) U3.6(VIN) U4.1(VIN) U4.3(EN)
+VBAT: BH1.1 TP17.1
-5V_A: C21.1 C22.1 FB3.2
A_GND: C11.1 C13.1 C14.1 C19.2 C21.2 C22.2 C24.1 C30.1 C31.1 C54.1 C56.2 C57.2 R64.1 U1.5(Common)
GND: BH1.2 C12.1 C15.1 C16.1 C17.1 C18.1 C23.1 C25.1 C28.1 C33.1 C34.1 C55.1 C58.2 D6.A LD1.K R28.1 R56.1 R64.2 T6.2(Source) T7.2(Source) U1.2(Vin-) U3.2(GND) U4.2(GND)
V_DET_CNTR_1: T6.1(Gate) ; port V_DET_CNTR_1
V_DET_CNTR_2: T7.1(Gate) ; port V_DET_CNTR_2
V_DET_TOOGLE: R57.1 U3.4(~{SHDN}) ; port V_DET_TOOGLE
NetC11_2: C11.2 C54.2 FB1.1 Q1.2
NetC16_2: C16.2 FB2.1 Q2.2
NetC19_1: C19.1 C57.1 FB3.1 Q3.2
NetC24_2: C24.2 Q1.1 U1.6(Vout+)
NetC56_1: C56.1 Q3.1 U1.4(Vout-)
NetLD1_A: LD1.A R34.1
NetQ4_1: Q4.1 U3.1(SW)
NetR27_1: R27.1 R28.2 R29.2 R30.2 TP19.1 U3.3(FB)
NetR29_1: R29.1 T6.3(Drain)
NetR30_1: R30.1 T7.3(Drain)

Not connected (* = marked no-connect by the designer): U4 4(NC)*

### Notes on the sheet
- fcutoff = 10.5kHz
- (near U1) switching freq = 65 kHz
- (near Q1) fcutoff = 10.5kHz
- V_DET_CNTR_1
- 0
- 1
- V_DET_CNTR_2
- +V_DET
- 27.11V
- 29.96V
- Power supply
- 32.80V
- 35.65V
- 2     8
- (in symbol BATTERY_HOLDER) +
- (in symbol NKA0505SC) I; S; O; L; A; T; N

### Library data of the parts
BH1 = BATTERY_HOLDER: KEYSTONE 3002 (CR2032); OrderNumber: 1650693; Supplier: FARNELL
C11-C19 C21-C25 C28 C30 C31 C33 C34 C54-C57 = CAPACITOR
C58 = CAPACITOR_ELCO
D6 = DIODE_TVS
FB1-FB3 FB5 = FERRITE_BEAD
LD1 = LED_RED: Type (0°): LTSTC170CKT; Type (90°): HSMS-C110
Q1-Q4 = COIL
R27-R30 R34 R56 R57 R64 = RESISTOR: Parameter 1: 10k
T6 T7 = MMBF170: N MOSFET
TP17-TP19 = TESTPOINT
U1 = NKA0505SC: MEA1D0505SC Isolated DC/DC Converters +/-5V 100mA
U3 = LT3461: 1.3 MHz Step-Up DC/DC Converter with Integrated Schottky, 6-pin SOT23 (S6-6), -40 to 85 degC, Pb-Free, Mini Tape and Reel; ComponentLink1Description: Datasheet; ComponentLink1URL: http://cds.linear.com/docs/en/datasheet/3461af.pdf

## Sheet MainBoard_V1p0_SD.SchDoc
size A4; SheetNumber: 7; SheetTotal: 8
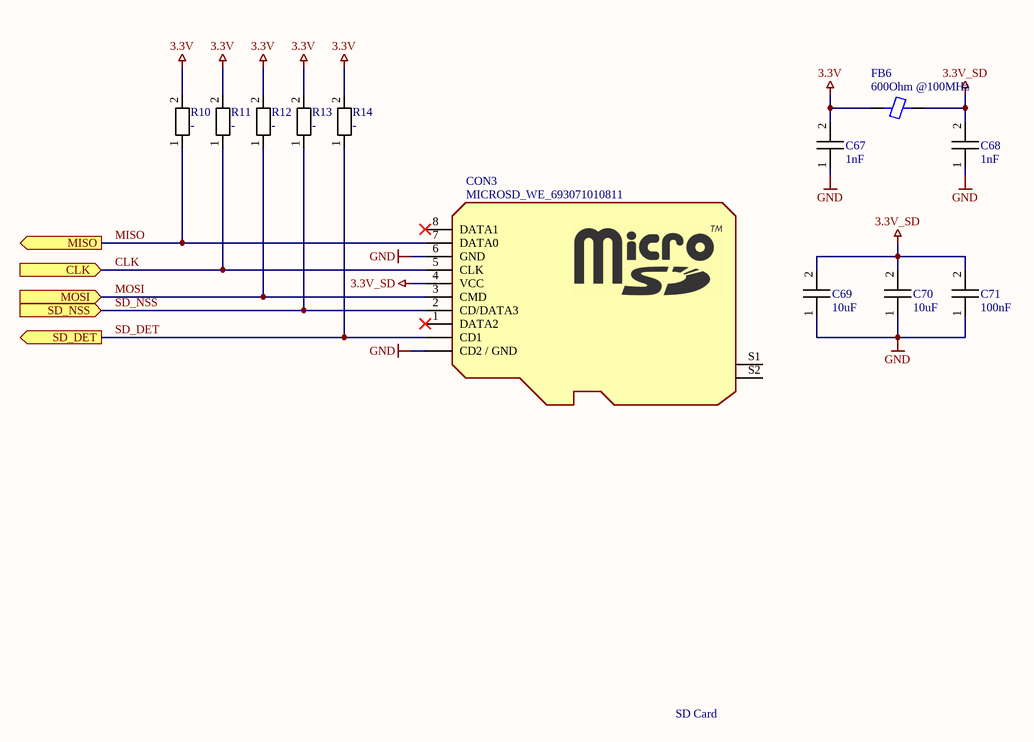
[diagram p6: MainBoard_V1p0_SD.SchDoc]

### Parts
C67  1nF  [0805_C]
C68  1nF  [0805_C]
C69  10uF  [1210_C]
C70  10uF  [1210_C]
C71  100nF  [0805_C]
CON3  MICROSD_WE_693071010811  [T_Wurth_693071010811]
FB6  600Ohm @100MHz  [0805_FB]
R10  -  [0805]
R11  -  [0805]
R12  -  [0805]
R13  -  [0805]
R14  -  [0805]

### Ports
CLK (in), MISO (out), MOSI (in), SD_DET (out), SD_NSS (in)

### Nets
3.3V: C67.2 FB6.1 R10.2 R11.2 R12.2 R13.2 R14.2
3.3V_SD: C68.2 C69.2 C70.2 C71.2 CON3.4(VCC) FB6.2
GND: C67.1 C68.1 C69.1 C70.1 C71.1 CON3.6(GND) CON3.CD2(CD2_/_GND)
CLK: CON3.5(CLK) R11.1 ; port CLK
MISO: CON3.7(DATA0) R10.1 ; port MISO
MOSI: CON3.3(CMD) R12.1 ; port MOSI
SD_DET: CON3.CD1 R14.1 ; port SD_DET
SD_NSS: CON3.2(CD/DATA3) R13.1 ; port SD_NSS

Not connected (* = marked no-connect by the designer): CON3 1(DATA2)* 8(DATA1)* S1(S) S2(S)

### Notes on the sheet
- SD Card

### Library data of the parts
C67-C71 = CAPACITOR
CON3 = MICROSD_WE_693071010811: Order Number: 2081363; Supplier: FARNELL
FB6 = FERRITE_BEAD
R10-R14 = RESISTOR: Parameter 1: 10k

## Sheet MainBoard_V1p0_TEMP.SchDoc
size 431 x 279 mm; SheetNumber: 9; SheetTotal: 9; SPICEModelCacheRKGVLAJQ: <root> / <DocumentId>RKGVLAJQ</DocumentId> / <CacheFrame Number="0"> / <Model Name="mcp6241" Kind="CKT"> / <Text>.SUBCKT MCP6241 1 2 3 4 5 / *               | | | | | / *               | | | | Output / *               | | | Negative Supply / *               | | Positive Supply / *               | Inverting Input / *               Non-inverting Input / * / ******************************************************************************** / * Software License Agreement                                                   * / *                                                                              * / * The software supplied herewith by Microchip Technology Incorporated (the     * / * 'Company') is intended and supplied to you, the Company's customer, for use  * / * soley and exclusively on Microchip products.                                 * / *                                                                              * / * The software is owned by the Company and/or its supplier, and is protected   * / * under applicable copyright laws. All rights are reserved. Any use in         * / * violation of the foregoing restrictions may subject the user to criminal     * / * sanctions under applicable laws, as well as to civil liability for the       * / * breach of the terms and conditions of this license.                          * / *                                                                              * / * THIS SOFTWARE IS PROVIDED IN AN 'AS IS' CONDITION. NO WARRANTIES, WHETHER    * / * EXPRESS, IMPLIED OR STATUTORY, INCLUDING, BUT NOT LIMITED TO, IMPLIED        * / * WARRANTIES OF MERCHANTABILITY AND FITNESS FOR A PARTICULAR PURPOSE APPLY TO  * / * THIS SOFTWARE. THE COMPANY SHALL NOT, IN ANY CIRCUMSTANCES, BE LIABLE FOR    * / * SPECIAL, INCIDENTAL OR CONSEQUENTIAL DAMAGES, FOR ANY REASON WHATSOEVER.     * / ******************************************************************************** / * / * The following op-amps are covered by this model: / *      MCP6241, MCP6241R, MCP6241U, MCP6242, MCP6244 / * / * Revision History: / *      REV A: 21-Aug-06, Created model / *      REV B: 27-Jul-07, Updated output impedance for better model stability w/cap load / *      REV C: 09-Jul-12, MCP6241R, MCP6241U / *      REV D: 23-Jan-15, Adjusted reverse recovery to resolve delay in single ended applications / * / * Recommendations: / *      Use PSPICE (other simulators may require translation) / *      For a quick, effective design, use a combination of: data sheet / *            specs, bench testing, and simulations with this macromodel / *      For high impedance circuits, set GMIN=100F in the .OPTIONS statement / * / * Supported: / *      Typical performance for temperature range (-40 to 125) degrees Celsius / *      DC, AC, Transient, and Noise analyses. / *      Most specs, including: offsets, DC PSRR, DC CMRR, input impedance, / *            open loop gain, voltage ranges, supply current, ... , etc. / *      Temperature effects for Ibias, Iquiescent, Iout short circuit / *            current, Vsat on both rails, Slew Rate vs. Temp and P.S. / * / * Not Supported: / *      Some Variation in specs vs. Power Supply Voltage / *      Monte Carlo (Vos, Ib), Process variation / *      Distortion (detailed non-linear behavior) / *      Behavior outside normal operating region / * / * Input Stage / V10  3 10 -500M / R10 10 11 6.90K / R11 10 12 6.90K / C11 11 12 7.20P / C12  1  0 6.00P / E12 71 14 POLY(4) 20 0 21 0 26 0 27 0   5.00M 34.9 34.9 1 1 / G12 1 0 62 0 1m / M12 11 14 15 15 NMI / M14 12 2 15 15 NMI / G14 2 0 62 0 1m / C14  2  0 6.00P / I15 15 4 50.0U / V16 16 4 -300M / GD16 16 1 TABLE {V(16,1)} ((-100,-1p)(0,0)(1m,1u)(2m,1m)) / V13 3 13 -300M / GD13 2 13 TABLE {V(2,13)} ((-100,-1p)(0,0)(1m,1u)(2m,1m)) / R71  1  0 20.0E12 / R72  2  0 20.0E12 / R73  1  2 20.0E12 / I80  1  2 500E-15 / * / * Noise, PSRR, and CMRR / I20 21 20 423U / D20 20  0 DN1 / D21  0 21 DN1 / G26  0 26 POLY(2) 3 0 4 0   0.00 -158U -3U / R26 26  0 1 / G27  0 27 POLY(2) 1 0 2 0  -776U 35.5U 35.5U / R27 27  0 1 / * / * Open Loop Gain, Slew Rate / G30  0 30 12 11 1 / R30 30  0 1.00K / C30 30 0 10p / G31 0 31 3 4 2 / I31 0 31 DC 65 / R31 31  0 1 TC=3.67M,5.32U / GD31 30 0 TABLE {V(30,31)} ((-100,-1u)(0,0)(1m,.1)(2m,2)) / G32 32 0 3 4 -1.9 / I32 32 0 DC 105 / R32 32  0 1 TC=3.43M,4.42U / GD32 0 30 TABLE {V(30,32)} ((-2m,2)(-1m,.1)(0,0)(100,1u)) / G33  0 33 30 0 1m / R33  33 0 1K / G34  0 34 33 0 316M / R34  34 0 1K / C34  34 0 81.8U / G37  0 37 34 0 1m / R37  37 0 1K / C37  37 0 22.7P / G38  0 38 37 0 1m / R38  39 0 1K / L38  38 39 26.5U / E38  35 0 38 0 1 / * Original Reverse Recovery / *G35 33 0 TABLE {V(35,3)} ((-1,-1n)(0,0)(48,1n))(49,1)) / *G36 33 0 TABLE {V(35,4)} ((-49,-1)((-48,-1n)(0,0)(1,1n)) / * Adjusted Reverse Recovery to resolve delay seen on single ended applications 01-23-15 / G35 33 0 TABLE {V(35,3)} ((-1,-1n)(0,0)(2,1n))(3,1)) / G36 33 0 TABLE {V(35,4)} ((-3,-1)((-2,-1n)(0,0)(1,1n)) / * / * Output Stage / R80 50 0 100MEG / G50 0 50 57 96 2 / R58 57  96 0.50 / R57 57  0 1650 / C58  5  0 2.00P / G57  0 57 POLY(3) 3 0 4 0 35 0   0 0.21M 0.21M 0.6M / GD55 55 57 TABLE {V(55,57)} ((-2m,-1)(-1m,-1m)(0,0)(10,1n)) / GD56 57 56 TABLE {V(57,56)} ((-2m,-1)(-1m,-1m)(0,0)(10,1n)) / E55 55  0 POLY(2) 3 0 51 0 -0.85M 1 -51.0M / E56 56  0 POLY(2) 4 0 52 0 1.33M 1 -42.0M / R51 51 0 1k / R52 52 0 1k / GD51 50 51 TABLE {V(50,51)} ((-10,-1n)(0,0)(1m,1m)(2m,1)) / GD52 50 52 TABLE {V(50,52)}  ((-2m,-1)(-1m,-1m)(0,0)(10,1n)) / G53  3  0 POLY(1) 51 0  -50.0U 1M / G54  0  4 POLY(1) 52 0  -50.0U -1M / * / * Current Limit / G99 96 5 99 0 1 / R98 0 98 1 TC=-1.92M,-7.58U / G97 0 98 TABLE { V(96,5) } ((-11.0,-21.0M)(-1.00M,-20.7M)(0,0)(1.00M,20.7M)(11.0,21.0M)) / E97 99 0 VALUE { V(98)*((V(3)-V(4))*166M + 416M)} / D98 4 5 DESD / D99 5 3 DESD / * / * Temperature / Voltage Sensitive IQuiscent / R61 0 61 1 TC=3.14M,7.28U / G61 3 4 61 0 1 / G60 0 61 TABLE {V(3, 4)} / + ((0,0)(750M,450N)(800M,1.00U)(900M,4.00U) / + (1.2,41.0U)(1.4,45.0U)(5.5,46.0U)) / * / * Temperature Sensistive offset voltage / I73 0 70 DC 1uA / R74 0 70 1 TC=3.00U / E75 1 71 70 0 1 / * / * Temp Sensistive IBias / I62 0 62 DC 1uA / R62 0 62 REXP 55.78U / * / * Models / .MODEL NMI NMOS(L=2.00U W=42.0U KP=20.0U LEVEL=1 ) / .MODEL DESD  D   N=1 IS=1.00E-15 / .MODEL DN1 D   IS=1P KF=146E-18 AF=1 / .MODEL REXP RES TCE=10.14 / .ENDS MCP6241</Text> / </Model> / </CacheFrame> / </root>
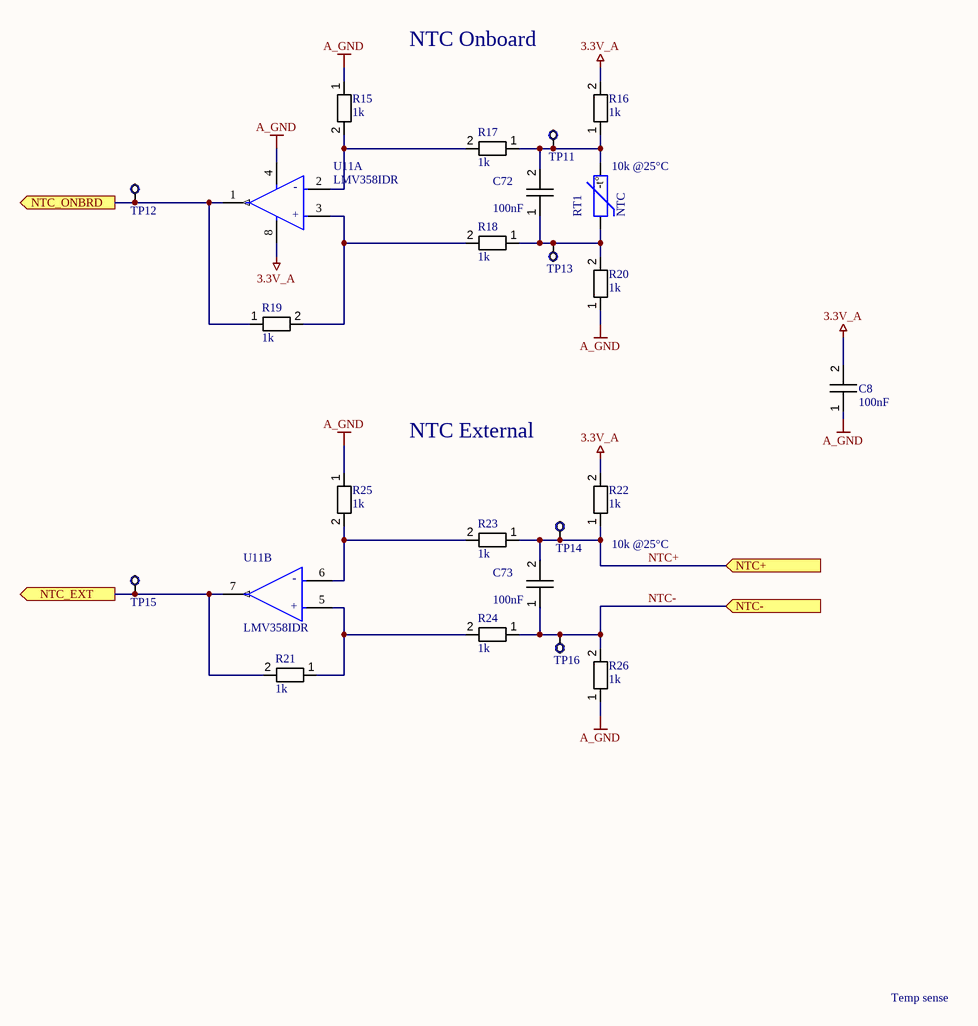
[diagram p7: MainBoard_V1p0_TEMP.SchDoc]

### Parts
C8  100nF  [0805_C]
C72  100nF  [0805_C]
C73  100nF  [0805_C]
R15  1k  [0805]
R16  1k  [0805]
R17  1k  [0805]
R18  1k  [0805]
R19  1k  [0805]
R20  1k  [0805]
R21  1k  [0805]
R22  1k  [0805]
R23  1k  [0805]
R24  1k  [0805]
R25  1k  [0805]
R26  1k  [0805]
RT1  NTC  [0805]
TP11  ?  [PAD_40]  (value not drawn)  (no BOM)
TP12  ?  [PAD_40]  (value not drawn)  (no BOM)
TP13  ?  [PAD_40]  (value not drawn)  (no BOM)
TP14  ?  [PAD_40]  (value not drawn)  (no BOM)
TP15  ?  [PAD_40]  (value not drawn)  (no BOM)
TP16  ?  [PAD_40]  (value not drawn)  (no BOM)
U11  LMV358IDR  [SO-8]  (parts A,B of 2)

### Ports
NTC+ (in), NTC- (in), NTC_EXT (out), NTC_ONBRD (out)

### Nets
3.3V_A: C8.2 R16.2 R22.2 U11.8(VCC+)
A_GND: C8.1 R15.1 R20.1 R25.1 R26.1 U11.4(GND)
EXT_NTC: R21.2 TP15.1 U11.7(2OUT) ; port NTC_EXT
NTC+: C73.2 R22.1 R23.1 TP14.1 ; port NTC+
NTC-: C73.1 R24.1 R26.2 TP16.1 ; port NTC-
ONBRD_NTC: R19.1 TP12.1 U11.1(OUT) ; port NTC_ONBRD
NetC72_1: C72.1 R18.1 R20.2 RT1.1 TP13.1
NetC72_2: C72.2 R16.1 R17.1 RT1.2 TP11.1
NetR15_2: R15.2 R17.2 U11.2(1IN-)
NetR18_2: R18.2 R19.2 U11.3(1IN+)
NetR21_1: R21.1 R24.2 U11.5(2IN+)
NetR23_2: R23.2 R25.2 U11.6(2IN-)

### Notes on the sheet
- NTC Onboard
- (near RT1) 10k @25°C
- NTC External
- (near R22) 10k @25°C
- Temp sense
- DWG. NO.
- REV.
- SHT.
- THIS DOCUMENT AND THE DATA DISCLOSED HEREIN OR HEREWITH IS THE PROPERTY OF ALTIUM LIMITED AND MAY BE FREELY DISTRIBUTED IN WHOLE. NO RIGHTS ARE RESERVED OR EXPRESS OR IMPLIED WARANTEE GIVEN.
- REVISION
- DESCRIPTION
- DATE
- APPROVED
- ENG:
- APPROVALS
- PROJECT
- DSN:
- CHK:
- REFERENCE DOCUMENTS
- PROJECT REVISION:
- TITLE
- DOCUMENT REVISION:
- DESIGN ITEM:
- BOM:
- FAB DWG:
- PCB DWG:
- ASSY DWG:
- SCALE:
- SIZE
- B
- CAGE CODE
- FILE NAME
- DWG NO.
- SHEET
- OF
- REV
- (in symbol LMV358IDR, part A) -; +
- (in symbol LMV358IDR, part B) -; +
- (in symbol NTC) -t°

### Library data of the parts
C8 C72 C73 = CAPACITOR
R15-R26 = RESISTOR: Parameter 1: 10k
TP11-TP16 = TESTPOINT
U11 = LMV358IDR: IC OPAMP GP 2 CIRCUIT 8SOIC; Number of Elements: 2; Min Supply Voltage: 2.7V; Input Bias Current: 250nA; Output Current per Channel: 160mA; Bandwidth: 1MHz; Voltage Gain: 100dB; Input Offset Voltage (Vos): 7mV; Slew Rate: 1V/µs; Nominal Supply Current: 440uA; Power Supply Rejection Ratio (PSRR): 50dB; Max Supply Voltage: 5.5V; Operating Supply Current: 210uA; Lead Free: Lead Free; Length: 4.9mm; RoHS Compliant: Yes; REACH SVHC: No SVHC; Case/Package: SOIC; Height: 1.58mm; Number of Channels: 2; Number of Amplifiers: 2; Radiation Hardening: No; Number of Circuits: 2; Mount: Surface Mount; Contact Plating: Gold; Unity Gain Bandwidth Product: 1MHz; Min Operating Temperature: -40°C; Max Operating Temperature: 125°C; Width: 3.91mm; Gain Bandwidth Product: 1MHz; Number of Pins: 8; Packaging: Tape and Reel; Package Quantity: 2500; Output Current: 160mA; Common Mode Rejection Ratio: 50dB

## Nets that join several sheets
3.3V: MainBoard_V1p0_CON (8 pins), MainBoard_V1p0_MCU (16 pins), MainBoard_V1p0_PER (9 pins), MainBoard_V1p0_PSU (C28.2 C58.1 FB5.1 U4.5), MainBoard_V1p0_SD (7 pins)
3.3V_A: MainBoard_V1p0_ANA (R50.2 R51.2 U10.8), MainBoard_V1p0_MCU (C63.2 D10.2 U2.9), MainBoard_V1p0_PSU (C30.2 C31.2 FB5.2), MainBoard_V1p0_TEMP (C8.2 R16.2 R22.2 U11.8)
+5V_A: MainBoard_V1p0_ANA (C1.3 C9.3 C10.3 C41.3), MainBoard_V1p0_CON (D13.2), MainBoard_V1p0_PSU (C13.2 C14.2 FB1.2)
+V_DET: MainBoard_V1p0_CON (J1.1), MainBoard_V1p0_PSU (7 pins)
+V_USB: MainBoard_V1p0_CON (C65.1 D5.5 F1.2 VR1.2), MainBoard_V1p0_PSU (C15.2 Q2.1 R34.2)
+VBAT: MainBoard_V1p0_MCU (D1.2), MainBoard_V1p0_PSU (BH1.1 TP17.1)
-5V_A: MainBoard_V1p0_ANA (C20.3 C27.3 C47.3), MainBoard_V1p0_PSU (C21.1 C22.1 FB3.2)
A_GND: MainBoard_V1p0_ANA (16 pins), MainBoard_V1p0_CON (D13.1 J2.2,3,4 R9.1), MainBoard_V1p0_MCU (5 pins), MainBoard_V1p0_PSU (14 pins), MainBoard_V1p0_TEMP (6 pins)
GND: MainBoard_V1p0_CON (21 pins), MainBoard_V1p0_MCU (16 pins), MainBoard_V1p0_PER (10 pins), MainBoard_V1p0_PSU (23 pins), MainBoard_V1p0_SD (7 pins)
BOOT0: MainBoard_V1p0_MCU (R4.1 R6.2 U2.44), MainBoard_V1p0_PER (SW3.1 SW3.2)
CLK: MainBoard_V1p0_MCU (C64.2 R62.2), MainBoard_V1p0_SD (CON3.5 R11.1)
DET_CON: MainBoard_V1p0_CON (D7.3 J1.2), MainBoard_V1p0_MCU (U2.20)
DET_SIGNAL: MainBoard_V1p0_ANA (C32.1), MainBoard_V1p0_CON (D13.3 J2.1 R9.2 TP10.1)
EXT_NTC: MainBoard_V1p0_MCU (U2.15), MainBoard_V1p0_TEMP (R21.2 TP15.1 U11.7)
LED_COM: MainBoard_V1p0_MCU (U2.43), MainBoard_V1p0_PER (T2.1)
LED_CON: MainBoard_V1p0_MCU (U2.45), MainBoard_V1p0_PER (T3.1)
LED_RUN: MainBoard_V1p0_MCU (U2.13), MainBoard_V1p0_PER (T5.1)
LED_SD: MainBoard_V1p0_MCU (U2.46), MainBoard_V1p0_PER (T4.1)
MISO: MainBoard_V1p0_MCU (U2.40), MainBoard_V1p0_SD (CON3.7 R10.1)
MOSI: MainBoard_V1p0_MCU (U2.41), MainBoard_V1p0_SD (CON3.3 R12.1)
NetR31_1: MainBoard_V1p0_ANA (R44.1 TP9.1 U5.6), MainBoard_V1p0_MCU (R31.1)
NTC+: MainBoard_V1p0_CON (D8.3 J1.3), MainBoard_V1p0_TEMP (C73.2 R22.1 R23.1 TP14.1)
NTC-: MainBoard_V1p0_CON (D9.3 J1.4), MainBoard_V1p0_TEMP (C73.1 R24.1 R26.2 TP16.1)
ONBRD_NTC: MainBoard_V1p0_MCU (U2.14), MainBoard_V1p0_TEMP (R19.1 TP12.1 U11.1)
Peak_DET_RST: MainBoard_V1p0_ANA (T8.1), MainBoard_V1p0_MCU (U2.18)
SCL: MainBoard_V1p0_CON (D11.3 J1.6), MainBoard_V1p0_MCU (R2.1 TP1.1 U2.21 U12.6)
SD_DET: MainBoard_V1p0_MCU (U2.11), MainBoard_V1p0_SD (CON3.CD1 R14.1)
SD_NSS: MainBoard_V1p0_MCU (U2.38), MainBoard_V1p0_SD (CON3.2 R13.1)
SDA: MainBoard_V1p0_CON (D12.3 J1.7), MainBoard_V1p0_MCU (R1.1 TP2.1 U2.22 U12.5)
START_BTN: MainBoard_V1p0_MCU (U2.42), MainBoard_V1p0_PER (C53.2 R39.2 SW1.1)
SWDCLK: MainBoard_V1p0_CON (P1.6), MainBoard_V1p0_MCU (U2.37)
SWDIO: MainBoard_V1p0_CON (P1.4), MainBoard_V1p0_MCU (U2.34)
SYS_BEEP: MainBoard_V1p0_MCU (U2.12), MainBoard_V1p0_PER (R38.2 T1.1)
SYS_RESET: MainBoard_V1p0_CON (P1.12), MainBoard_V1p0_MCU (R3.1 R5.2 U2.7), MainBoard_V1p0_PER (C52.2 R37.1 SW2.2)
THRESHOLD_IRQ: MainBoard_V1p0_ANA (R51.1 TP20.1 U10.1), MainBoard_V1p0_MCU (U2.17)
UART_RX: MainBoard_V1p0_CON (P1.13), MainBoard_V1p0_MCU (U2.31)
UART_TX: MainBoard_V1p0_CON (P1.14), MainBoard_V1p0_MCU (U2.30)
USB_D+: MainBoard_V1p0_CON (R8.2 R53.2), MainBoard_V1p0_MCU (U2.33)
USB_D-: MainBoard_V1p0_CON (R7.2), MainBoard_V1p0_MCU (U2.32)
V_DET_CNTR_1: MainBoard_V1p0_MCU (U2.26), MainBoard_V1p0_PSU (T6.1)
V_DET_CNTR_2: MainBoard_V1p0_MCU (U2.27), MainBoard_V1p0_PSU (T7.1)
V_DET_TOOGLE: MainBoard_V1p0_MCU (U2.25), MainBoard_V1p0_PSU (R57.1 U3.4)